# Altium schematic sheet Main.SchDoc: PWR+Radio+MCU+PA
size A3; SheetNumber: 2; SheetTotal: 2; Time: PWR+Radio+MCU+PA
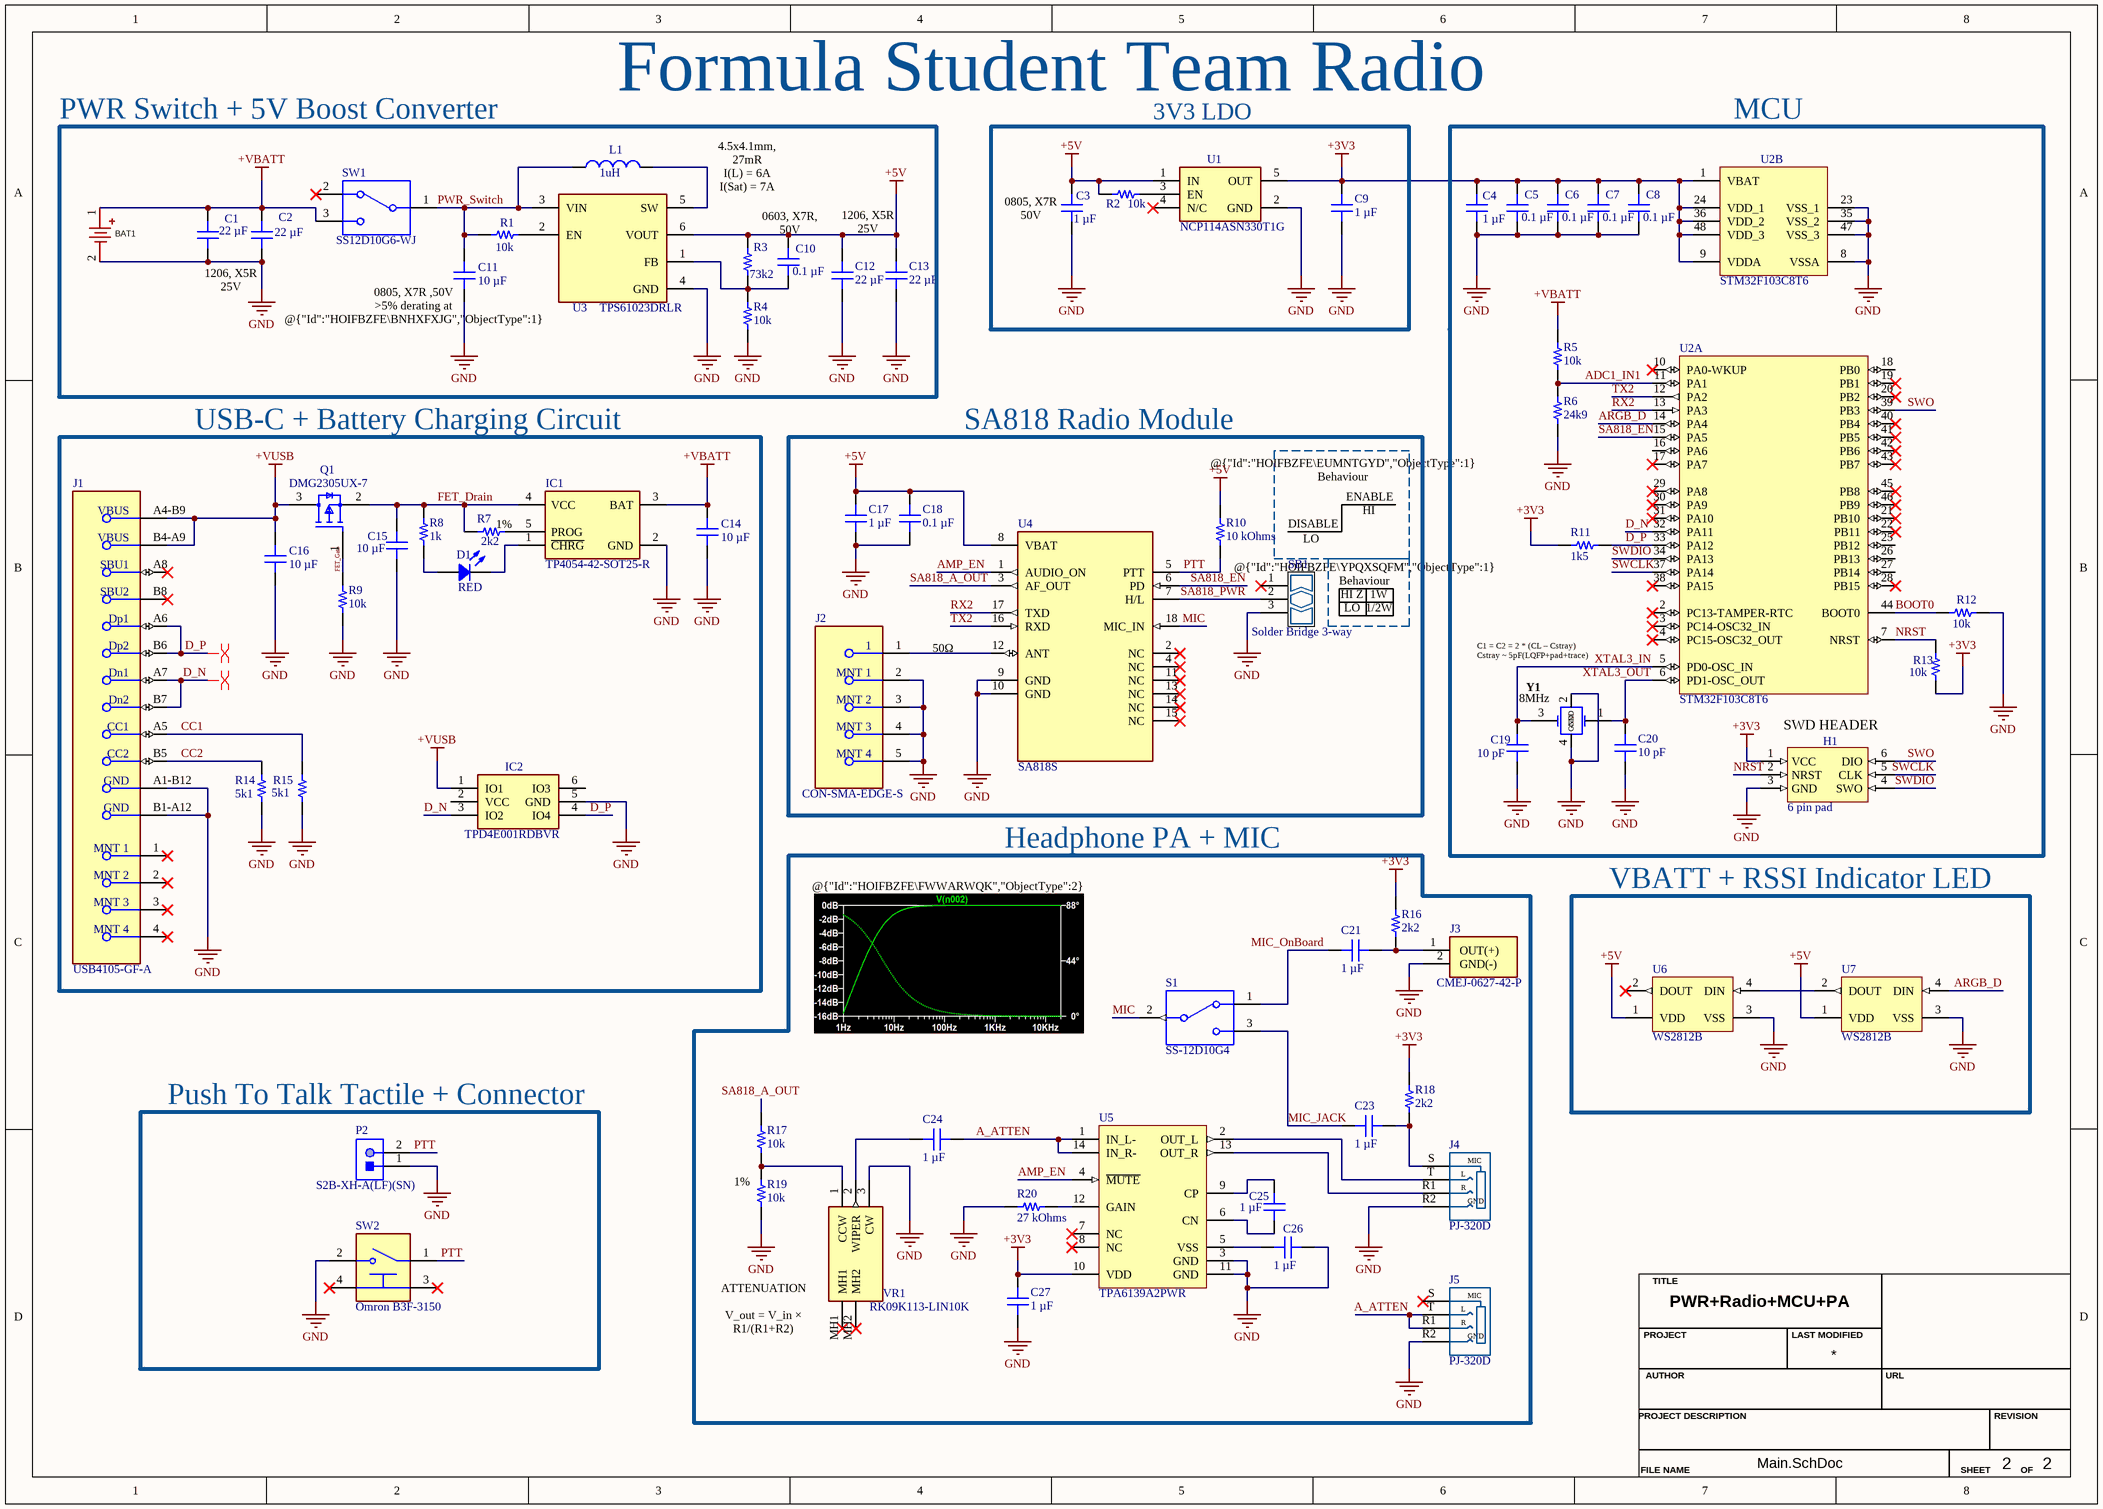
[diagram p0: Main.SchDoc]

## Parts
BAT1  BH-123A-A1CJ002  [BAT-TH_BH-123A-A5BJ002]  (value not drawn)
C1  22 µF  [MURATA CAP GRM31C 1206_3216]
C2  22 µF  [MURATA CAP GRM31C 1206_3216]
C3  1 µF  [MURATA GRT21 0805_2012]
C4  1 µF  [MURATA GRT21 0805_2012]
C5  0.1 µF  [CAP 0603_1608]
C6  0.1 µF  [CAP 0603_1608]
C7  0.1 µF  [CAP 0603_1608]
C8  0.1 µF  [CAP 0603_1608]
C9  1 µF  [MURATA GRT21 0805_2012]
C10  0.1 µF  [CAP 0603_1608]
C11  10 µF  [MURATA GRM21B 0805_2012]
C12  22 µF  [MURATA CAP GRM31C 1206_3216]
C13  22 µF  [MURATA CAP GRM31C 1206_3216]
C14  10 µF  [MURATA GRM21B 0805_2012]
C15  10 µF  [MURATA GRM21B 0805_2012]
C16  10 µF  [MURATA GRM21B 0805_2012]
C17  1 µF  [MURATA GRT21 0805_2012]
C18  0.1 µF  [CAP 0603_1608]
C19  10 pF  [MURATA GCM188 0603_1608]
C20  10 pF  [MURATA GCM188 0603_1608]
C21  1 µF  [MURATA GRT21 0805_2012]
C23  1 µF  [MURATA GRT21 0805_2012]
C24  1 µF  [MURATA GRT21 0805_2012]
C25  1 µF  [MURATA GRT21 0805_2012]
C26  1 µF  [MURATA GRT21 0805_2012]
C27  1 µF  [MURATA GRT21 0805_2012]
D1  RED  [LED 0603_1608 RED]
H1  6 pin pad  [6 pin pad-Footprint-1]
IC1  TP4054-42-SOT25-R  [SOT95P280X100-5N]
IC2  TPD4E001RDBVR  [SOT95P280X145-6N]
J1  USB4105-GF-A  [FP-USB4105-GF-A-MFG]
J2  CON-SMA-EDGE-S  [FP-CON-SMA-EDGE-S-MFG]
J3  CMEJ-0627-42-P  [CMEJ062742P]
J4  PJ-320D  [PJ320D]
J5  PJ-320D  [PJ320D]
L1  1uH  [INDM4843X20N]
P2  S2B-XH-A(LF)(SN)  [JST-S2B-XH-A(LF)(SN)_V]
Q1  DMG2305UX-7  [FP-SOT23-IPC_C]
R1  10k  [RES 0603_1608]
R2  10k  [RES 0603_1608]
R3  73k2  [RES 0603_1608]
R4  10k  [RES 0603_1608]
R5  10k  [RES 0603_1608]
R6  24k9  [RES 0603_1608]
R7  2k2  [RES 0603_1608]
R8  1k  [RES 0603_1608]
R9  10k  [RES 0603_1608]
R10  10 kOhms  [RES 0603_1608]
R11  1k5  [RES 0603_1608]
R12  10k  [RES 0603_1608]
R13  10k  [RES 0603_1608]
R14  5k1  [KOA RES RK73 RN73 0603_1608]
R15  5k1  [KOA RES RK73 RN73 0603_1608]
R16  2k2  [RES 0603_1608]
R17  10k  [RES 0603_1608]
R18  2k2  [RES 0603_1608]
R19  10k  [RES 0603_1608]
R20  27 kOhms  [RES 0603_1608]
S1  SS-12D10G4  [SS12D10G4]
SB1  Solder Bridge 3-way  [Solder Bridge 3-way-Footprint-1]
SW1  SS12D10G6-WJ  [SHOU HAN SS12D10G6-WJ-Footprint-1]
SW2  Omron B3F-3150  [FP-B3F-3150-MFG]
U1  NCP114ASN330T1G  [SOT95P275X110-5N]
U2  STM32F103C8T6  [STM-LQFP48_L]  (parts A,B of 2)
U3  TPS61023DRLR  [FP-DRL0006A-MFG]
U4  SA818S  [XCVR_SA818S]
U5  TPA6139A2PWR  [PW0014A_N]
U6  WS2812B  [ADAI-WS2812B_V]
U7  WS2812B  [ADAI-WS2812B_V]
VR1  RK09K113-LIN10K  [RK09K113LIN10K]
Y1  8MHz  [Yajingxin TX32258M4DBDD2T-Footprint-1]

## Blocks framed on the sheet
PWR Switch + 5V Boost Converter: BAT1 C1 C2 C10-C13 L1 R1 R3 R4 SW1 U3
3V3 LDO: C3 C9 R2 U1
MCU: C4-C8 C19 C20 H1 R5 R6 R11-R13 U2 Y1
USB-C + Battery Charging Circuit: C14-C16 D1 IC1 IC2 J1 Q1 R7-R9 R14 R15
SA818 Radio Module: C17 C18 J2 R10 SB1 U4
Headphone PA + MIC: C21 C23-C27 J3-J5 R16-R20 S1 U5 VR1
VBATT + RSSI Indicator LED: U6 U7
Push To Talk Tactile + Connector: P2 SW2

## Nets
+3V3: C4.2 C5.2 C6.2 C7.2 C8.2 C9.2 C27.1 H1.1(VCC) R11.2 R13.2 R16.2 R18.1 U1.5(OUT) U2.1(VBAT) U2.9(VDDA) U2.24(VDD_1) U2.36(VDD_2) U2.48(VDD_3) U5.10(VDD)
+5V: C3.2 C10.2 C12.2 C13.2 C17.2 C18.2 R2.1 R3.2 R10.2 U1.1(IN) U3.6(VOUT) U4.8(VBAT) U6.1(VDD) U7.1(VDD)
+VBATT: BAT1.1 C1.2 C2.2 C14.2 IC1.3(BAT) R5.2 SW1.3
+VUSB: C16.2 IC2.1(IO1) J1.A4-B9(VBUS) J1.B4-A9(VBUS) Q1.3(DRAIN)
GND: BAT1.2 C1.1 C2.1 C3.1 C4.1 C5.1 C6.1 C7.1 C8.1 C9.1 C11.1 C12.1 C13.1 C14.1 C15.1 C16.1 C17.1 C18.1 C19.1 C20.1 C26.2 C27.2 H1.3(GND) IC1.2(GND) IC2.5(GND) J1.A1-B12(GND) J1.B1-A12(GND) J2.2(MNT_1) J2.3(MNT_2) J2.4(MNT_3) J2.5(MNT_4) J3.2(GND(-)) J4.R2 J5.R2 P2.1 R4.1 R6.1 R9.1 R12.1 R14.1 R15.1 R19.1 R20.1 SB1.3 SW2.2 U1.2(GND) U2.8(VSSA) U2.23(VSS_1) U2.35(VSS_2) U2.47(VSS_3) U3.4(GND) U4.9(GND) U4.10(GND) U5.3(GND) U5.11(GND) U6.3(VSS) U7.3(VSS) VR1.3(CW) Y1.2(GND) Y1.4(GND)
A_ATTEN: C24.1 J5.R1 J5.T U5.1(IN_L-) U5.14(IN_R-)
ADC1_IN1: R5.1 R6.2 U2.11(PA1)
AMP_EN: U4.1(AUDIO_ON) U5.4(~{MUTE})
ARGB_D: U2.14(PA4) U7.4(DIN)
BOOT0: R12.2 U2.44(BOOT0)
CC1: J1.A5(CC1) R15.2
CC2: J1.B5(CC2) R14.2
D_N: IC2.3(IO2) J1.A7(Dn1) J1.B7(Dn2) U2.32(PA11)
D_P: IC2.4(IO4) J1.A6(Dp1) J1.B6(Dp2) R11.1 U2.33(PA12)
FET_Drain: C15.2 IC1.4(VCC) Q1.2(SOURCE) R7.1 R8.2
FET_Gate: Q1.1(GATE) R9.2
MIC: S1.2 U4.18(MIC_IN)
MIC_JACK: C23.2 S1.3
MIC_OnBoard: C21.2 S1.1
NRST: H1.2(NRST) R13.1 U2.7(NRST)
PTT: P2.2 R10.1 SW2.1 U4.5(PTT)
PWR_Switch: C11.2 L1.1 R1.1 SW1.1 U3.3(VIN)
RX2: U2.13(PA3) U4.17(TXD)
SA818_A_OUT: R17.2 U4.3(AF_OUT)
SA818_EN: U2.15(PA5) U4.6(PD)
SA818_PWR: SB1.2 U4.7(H/L)
SWCLK: H1.5(CLK) U2.37(PA14)
SWDIO: H1.4(SWO) U2.34(PA13)
SWO: H1.6(DIO) U2.39(PB3)
TX2: U2.12(PA2) U4.16(RXD)
XTAL3_IN: C19.2 U2.5(PD0-OSC_IN) Y1.3
XTAL3_OUT: C20.2 U2.6(PD1-OSC_OUT) Y1.1
NetC10_1: C10.1 R3.1 R4.2 U3.1(FB)
NetC21_1: C21.1 J3.1(OUT(+)) R16.1
NetC23_1: C23.1 J4.S R18.2
NetC24_2: C24.2 VR1.2(WIPER)
NetC25_1: C25.1 U5.9(CP)
NetC25_2: C25.2 U5.6(CN)
NetC26_1: C26.1 U5.5(VSS)
NetD1_1: D1.1 R8.1
NetD1_2: D1.2 IC1.1(~{CHRG})
NetIC1_5: IC1.5(PROG) R7.2
NetJ2_1: J2.1 U4.12(ANT)
NetJ4_R1: J4.R1 U5.13(OUT_R)
NetJ4_T: J4.T U5.2(OUT_L)
NetL1_2: L1.2 U3.5(SW)
NetR1_2: R1.2 U3.2(EN)
NetR2_2: R2.2 U1.3(EN)
NetR17_1: R17.1 R19.2 VR1.1(CCW)
NetR20_2: R20.2 U5.12(GAIN)
NetU6_4: U6.4(DIN) U7.2(DOUT)

Not connected (* = marked no-connect by the designer): IC2 2(VCC) 6(IO3); J1 1(MNT_1)* 2(MNT_2)* 3(MNT_3)* 4(MNT_4)* A8(SBU1)* B8(SBU2)*; J5 S*; SB1 1*; SW1 2(1)*; SW2 3(MNT_1)* 4(MNT_2)*; U1 4(N/C)*; U2 2(PC13-TAMPER-RTC)* 3(PC14-OSC32_IN)* 4(PC15-OSC32_OUT)* 10(PA0-WKUP)* 16(PA6) 17(PA7)* 18(PB0) 19(PB1)* 20(PB2)* 21(PB10)* 22(PB11)* 25(PB12) 26(PB13) 27(PB14) 28(PB15)* 29(PA8)* 30(PA9)* 31(PA10)* 38(PA15)* 40(PB4)* 41(PB5)* 42(PB6)* 43(PB7)* 45(PB8)* 46(PB9)*; U4 2(NC)* 4(NC)* 11(NC)* 13(NC)* 14(NC)* 15(NC)*; U5 7(NC)* 8(NC)*; U6 2(DOUT)*; VR1 MH1* MH2*

## Layout directives
differential pair: D_N, D_P

## Notes on the sheet
- Formula Student Team Radio
- 4.5x4.1mm, 27mR
  I(L) = 6A
  I(Sat) = 7A
- 0603, X7R, 50V
- 1206, X5R 25V
- (near C3) 0805, X7R
  50V
- (near C11) 0805, X7R ,50V
  >5% derating at @{"Id":"HOIFBZFE\BNHXFXJG","ObjectType":1}
- @{"Id":"HOIFBZFE\EUMNTGYD","ObjectType":1}
  Behaviour
- ENABLE
- HI
- (near R7) 1%
- DISABLE
- (near SB1) LO
- (near SB1) @{"Id":"HOIFBZFE\YPQXSQFM","ObjectType":1}
  Behaviour
- (near J2) 50Ω
- (near SB1) HI Z
- LO
- 1W
- 1/2W
- (near Y1) C1 = C2 = 2 * (CL – Cstray)
  Cstray ~ 5pF(LQFP+pad+trace)
- SWD HEADER
- @{"Id":"HOIFBZFE\FWWARWQK","ObjectType":2} + @{"Id":"HOIFBZFE\FYSAWRPW","ObjectType":2} High pass filter
- (near R19) 1%
- (near VR1) ATTENUATION
  V_out = V_in × R1/(R1+R2)
- TITLE
- AUTHOR
- PROJECT
- LAST MODIFIED
- URL
- PROJECT DESCRIPTION
- REVISION
- FILE NAME
- SHEET
- OF
- (in symbol PJ-320D) MIC; L; R; GND

## Library data of the parts
BAT1 = CMP-00029-00002-4: Manufacturer: MYOUNG(美阳); Convert to PCB: yes; Connector Type: Battery Holder; Symbol: BH-123A-A5BJ002; Battery Type: CR123A; Manufacturer Part: BH-123A-A1CJ002; Supplier Footprint: -; JLCPCB Part Class: Extended Part; Contact Material: Stainless Steel; Contact Plating: Nickel; Source: BH-123A-A5BJ0021_BH-123A-A5BJ002.SCHLIB; LCSC Part Name: 电池盒 适用电池:CR123A; Operating Temperature: -25℃~+85℃; Design Item ID: BH-123A-A1CJ002; Supplier Part: C5290177; Datasheet: https://item.szlcsc.com/datasheet/BH-123A-A1CJ002/6030883.html; Add into BOM: yes; Device: BH-123A-A1CJ002
C1 C2 C12 C13 = GRM31CC81E226KE11L: CAP CER 22UF 25V X6S 1206; manufacturer: Murata Electronics; Tolerance: ±10%; Part Number: GRM31CC81E226KE11L; Capacitance: 22 µF; Applications: General Purpose; componentlink1description: Datasheet; componentlink1url: https://search.murata.co.jp/Ceramy/image/img/A01X/G101/ENG/GRM31CC81E226KE11-01.pdf; componentlink2description: DigiKey Link; componentlink2url: https://www.digikey.com/en/products/detail/murata-electronics/GRM31CC81E226KE11L/6606097; Device Package: 1206 (3216 Metric); lastupdated: 7/27/2025 6:13:51 AM; Lifecycle Status: Active; Minimum Order: 1; Mounting Type: Surface Mount, MLCC; Operating Temperature: -55°C ~ 105°C; Package / Case: 1206 (3216 Metric); packaging: TapeAndReel; partid: 31407; Part Status: Active; price: 0.31; series: GRM; Size / Dimension: 0.126" L x 0.063" W (3.20mm x 1.60mm); Supplier 1: DigiKey; Supplier Part Number 1: 490-14468-1-ND; Temperature Coefficient: X6S; Thickness (Max): 0.075" (1.90mm); value: 22 µF; Voltage - Rated: 25V
C3 C4 C9 C17 C21 C23-C27 = GRT21BR71H105KE01L: CAP CER 1UF 50V X7R 0805; manufacturer: Murata Electronics; Tolerance: ±10%; Part Number: GRT21BR71H105KE01L; Capacitance: 1 µF; Applications: Automotive; componentlink1description: Datasheet; componentlink1url: https://search.murata.co.jp/Ceramy/image/img/A01X/G101/ENG/GRT21BR71H105KE01-01.pdf; componentlink2description: DigiKey Link; componentlink2url: https://www.digikey.com/en/products/detail/murata-electronics/GRT21BR71H105KE01L/10702345; Device Package: 0805 (2012 Metric); lastupdated: 7/27/2025 6:11:26 AM; Lifecycle Status: Active; Minimum Order: 1; Mounting Type: Surface Mount, MLCC; Operating Temperature: -55°C ~ 125°C; Package / Case: 0805 (2012 Metric); packaging: TapeAndReel; partid: 48766; Part Status: Active; price: 0.03; Ratings: AEC-Q200; series: GRT; Size / Dimension: 0.079" L x 0.049" W (2.00mm x 1.25mm); Supplier 1: DigiKey; Supplier Part Number 1: 490-GRT21BR71H105KE01LCT-ND; Temperature Coefficient: X7R; Thickness (Max): 0.053" (1.35mm); value: 1 µF; Voltage - Rated: 50V
C5-C8 C10 C18 = GCJ188R71H104KA12D: CAP CER 0.1UF 50V X7R 0603; manufacturer: Murata Electronics; Tolerance: ±10%; Part Number: GCJ188R71H104KA12D; Capacitance: 0.1 µF; Applications: Automotive, Boardflex Sensitive; componentlink1description: Datasheet; componentlink1url: https://www.murata.com/~/media/webrenewal/support/library/catalog/products/capacitor/mlcc/c03e.ashx?la=en-us; componentlink2description: DigiKey Link; componentlink2url: https://www.digikey.com/en/products/detail/murata-electronics/GCJ188R71H104KA12D/2783803; Device Package: 0603 (1608 Metric); Features: Soft Termination; lastupdated: 2/9/2024 8:10:08 PM; Lifecycle Status: Active; Minimum Order: 1; Mounting Type: Surface Mount, MLCC; Operating Temperature: -55°C ~ 125°C; Package / Case: 0603 (1608 Metric); packaging: TapeAndReel; partid: 16867; Part Status: Active; price: 0.01; Ratings: AEC-Q200; series: GCJ; Size / Dimension: 0.063" L x 0.031" W (1.60mm x 0.80mm); Supplier 1: DigiKey; Supplier Part Number 1: 490-5798-1-ND; Temperature Coefficient: X7R; Thickness (Max): 0.035" (0.90mm); value: 0.1 µF; Voltage - Rated: 50V
C11 C14-C16 = GRM21BR61H106ME43L: CAP CER 10UF 50V X5R 0805; manufacturer: Murata Electronics; Tolerance: ±20%; Part Number: GRM21BR61H106ME43L; Capacitance: 10 µF; Applications: General Purpose; componentlink1description: Datasheet; componentlink1url: https://search.murata.co.jp/Ceramy/image/img/A01X/G101/ENG/GRM21BR61H106ME43-01A.pdf; componentlink2description: DigiKey Link; componentlink2url: https://www.digikey.com/en/products/detail/murata-electronics/GRM21BR61H106ME43L/10326317; Device Package: 0805 (2012 Metric); lastupdated: 8/27/2024 9:29:56 AM; Lifecycle Status: Active; Minimum Order: 1; Mounting Type: Surface Mount, MLCC; Operating Temperature: -55°C ~ 85°C; Package / Case: 0805 (2012 Metric); packaging: TapeAndReel; partid: 41295; Part Status: Active; price: 0.05; series: GRM; Size / Dimension: 0.079" L x 0.049" W (2.00mm x 1.25mm); Supplier 1: DigiKey; Supplier Part Number 1: 490-18664-1-ND; Temperature Coefficient: X5R; Thickness (Max): 0.057" (1.45mm); value: 10 µF; Voltage - Rated: 50V
C19 C20 = GCM1885C2A100FA16D: CAP CER 10PF 100V C0G/NP0 0603; manufacturer: Murata Electronics; Temperature Coefficient: C0G, NP0; Tolerance: ±1%; Part Number: GCM1885C2A100FA16D; Capacitance: 10 pF; Applications: Automotive; componentlink1description: Datasheet; componentlink1url: https://search.murata.co.jp/Ceramy/image/img/A01X/G101/ENG/GCM1885C2A100FA16-01.pdf; componentlink2description: DigiKey Link; componentlink2url: https://www.digikey.com/en/products/detail/murata-electronics/GCM1885C2A100FA16D/11618736; Device Package: 0603 (1608 Metric); lastupdated: 7/20/2024 12:24:59 AM; Lifecycle Status: Active; Minimum Order: 1; Mounting Type: Surface Mount, MLCC; Operating Temperature: -55°C ~ 125°C; Package / Case: 0603 (1608 Metric); packaging: TapeAndReel; partid: 36047; Part Status: Active; price: 0.02; Ratings: AEC-Q200; series: GCM; Size / Dimension: 0.063" L x 0.031" W (1.60mm x 0.80mm); Supplier 1: DigiKey; Supplier Part Number 1: 490-GCM1885C2A100FA16DCT-ND; Thickness (Max): 0.035" (0.90mm); value: 10 pF; Voltage - Rated: 100V
D1 = B1931URO-20D000114U1930: LED RED DIFFUSED 0603 SMD; Manufacturer: Harvatek Corporation; Current - Test: 20mA; Lens Size: 1.00mm x 0.80mm; Lens Style: Rectangle with Flat Top; Millicandela Rating: 45mcd; Viewing Angle: 125°, 135°; Voltage - Forward (Vf) (Typ): 2V; Wavelength - Peak: 639nm; Part Number: B1931URO-20D000114U1930; Color: Red; ComponentLink2Description: DigiKey Link; ComponentLink2URL: https://www.digikey.com/en/products/detail/harvatek-corporation/B1931URO-20D000114U1930/15910603; Device Package: 0603 (1608 Metric); LastUpdated: 6/3/2024 7:59:45 PM; Lens Transparency: Diffused; Lifecycle Status: Active; Minimum Order: 1; Mounting Type: Surface Mount; Package / Case: 0603 (1608 Metric); Packaging: TapeAndReel; PartId: 1009; Part Status: Active; Price: 0.04; Series: -; Size / Dimension: 1.60mm L x 0.80mm W; Supplier 1: DigiKey; Supplier Part Number 1: 3147-B1931URO-20D000114U1930CT-ND; Supplier Device Package: 0603
H1 = CMP-002-00084-1
IC1 = TP4054-42-SOT25-R: Integrated Circuit; Manufacturer_Name: TOP POWER; Datasheet Link: http://images.100y.com.tw/pdf_file/38-TP-TP4054x.pdf; Height: 1mm; Manufacturer_Part_Number: TP4054-42-SOT25-R
IC2 = TPD4E001RDBVR: Integrated Circuit; Manufacturer_Name: Texas Instruments; Datasheet Link: http://www.ti.com/lit/gpn/TPD4E001; Height: 1.45mm; Manufacturer_Part_Number: TPD4E001RDBVR; Mouser Part Number: 595-TPD4E001RDBVR; Mouser Price/Stock: https://www.mouser.co.uk/ProductDetail/Texas-Instruments/TPD4E001RDBVR?qs=P1JMDcb91o7xMbcYcXI1uw%3D%3D; Arrow Part Number: TPD4E001RDBVR; Arrow Price/Stock: https://www.arrow.com/en/products/tpd4e001rdbvr/texas-instruments?utm_currency=USD&region=nac
J1 = CMP-002-00071-2: Conn USB 2.0 Type C RCP 24 POS 0.3mm/0.5mm Solder RA SMD 24 Terminal 1 Port T/R
J2 = CMP-002-00085-1: Sma Female Connector, Pcb Edge Mount Rohs Compliant: Yes; Case/Package: SMA; Pins: 1
J3 = CMEJ-0627-42-P: Connector; Manufacturer_Name: Same Sky; Datasheet Link: https://www.sameskydevices.com/product/resource/cmej-0627-42-p.pdf; Height: 3.18mm; Manufacturer_Part_Number: CMEJ-0627-42-P; Mouser Part Number: 490-CMEJ-0627-42-P; Mouser Price/Stock: https://www.mouser.co.uk/ProductDetail/CUI-Devices/CMEJ-0627-42-P?qs=PzGy0jfpSMsjZjkg1iQyPQ%3D%3D; Arrow Part Number: CMEJ-0627-42-P; Arrow Price/Stock: https://www.arrow.com/en/products/cmej-0627-42-p/cui-devices
J4 J5 = PJ-320D: Connector; Manufacturer_Name: Audio-Technica; Datasheet Link: https://p.globalsources.com/IMAGES/PDT/SPEC/432/K1007154432.pdf; Height: 5.75mm; Manufacturer_Part_Number: PJ-320D
L1 = CMP-006-00027-1: 1uH, 6A, 27mR, SMD 4.5x4.1mm
P2 = CMP-002-00032-2: Male Header, Pitch 2.5 mm, 1 x 2 Position, Height 6.1 mm, Tail Length 3.4 mm, -25 to 85 degC, RoHS, Bulk; Manufacturer: JST; Case/Package: S2B-XH-A(LF)(SN); Package Description: XH Series Disconnectable Crimp Style Connector, Pitch 2.5 mm, 1 x 2 Position, Height 6.1 mm, Tail Length 3.4 mm; Manufacturer URL: http://www.jst.com/home2.html; Datasheet URL: http://www.jst-mfg.com/product/pdf/eng/eXH.pdf; Connector Type: Header; Package Reference: S2B-XH-A(LF)(SN); Mounting Technology: TH; Max Operating Temperature: 85°C; Min Operating Temperature: -25°C; Datasheet Version: May-16; Gender: Male; RoHS Compliant: Unknown
Q1 = CMP-019-00063-1: P-Channel 20 V 52 mOhm Surface Mount Enhancement Mode Mosfet - SOT-23-3; Max Power Dissipation: 1.4W; Pins: 3; Max Operating Temperature: 150°C; Mounting Technology: Surface Mount; Case/Package: SOT-23; Min Operating Temperature: -55°C
R1 R2 = RCS060310K0JNEA: RES SMD 10K OHM 5% 1/4W 0603; Manufacturer: Vishay Dale; Power (Watts): 0.25W, 1/4W; Resistance: 10 kOhms; Temperature Coefficient: ±200ppm/°C; Part Number: RCS060310K0JNEA; Value: 10k; ComponentLink1Description: Datasheet; ComponentLink1URL: http://www.vishay.com/docs/20065/rcse3.pdf; ComponentLink2Description: DigiKey Link; ComponentLink2URL: https://www.digikey.com/en/products/detail/vishay-dale/RCS060310K0JNEA/5866963; Composition: Thick Film; Device Package: 0603 (1608 Metric); Features: Automotive AEC-Q200, Pulse Withstanding; Height - Seated (Max): 0.020" (0.50mm); LastUpdated: 2/9/2024 8:43:35 PM; Lifecycle Status: Active; Minimum Order: 1; Number of Terminations: 2; Operating Temperature: -55°C ~ 155°C; Package / Case: 0603 (1608 Metric); Packaging: TapeAndReel; PartId: 5383; Part Status: Active; Price: 0.01; Ratings: AEC-Q200; Series: RCS e3; Size / Dimension: 0.061" L x 0.033" W (1.55mm x 0.85mm); Supplier 1: DigiKey; Supplier Part Number 1: 541-2817-1-ND; Supplier Device Package: 0603; Tolerance: ±5%
R3 = ESR03EZPF7322: ANTI-SURGE CHIP RESISTORS; Manufacturer: Rohm Semiconductor; Power (Watts): 0.25W, 1/4W; Resistance: 73.2 kOhms; Temperature Coefficient: ±100ppm/°C; Tolerance: ±1%; Part Number: ESR03EZPF7322; Value: 73k2; ComponentLink1Description: Datasheet; ComponentLink1URL: https://www.rohm.com/datasheet?p=ESR01MZPF&dist=Digi-key&media=referral&source=digi-key.com&campaign=Digi-key; ComponentLink2Description: DigiKey Link; ComponentLink2URL: https://www.digikey.com/en/products/detail/rohm-semiconductor/ESR03EZPF7322/20486496; Composition: Thick Film; Device Package: 0603 (1608 Metric); Features: Automotive AEC-Q200, Pulse Withstanding; Height - Seated (Max): 0.022" (0.55mm); LastUpdated: 2/9/2024 8:40:36 PM; Lifecycle Status: Active; Minimum Order: 1; Number of Terminations: 2; Operating Temperature: -55°C ~ 155°C; Package / Case: 0603 (1608 Metric); Packaging: TapeAndReel; PartId: 80019; Price: 0.02; Ratings: AEC-Q200; Series: ESR; Size / Dimension: 0.063" L x 0.031" W (1.60mm x 0.80mm); Supplier 1: DigiKey; Supplier Part Number 1: 511-ESR03EZPF7322CT-ND; Supplier Device Package: 0603
R4 R5 R8 R9 R17 = TNPW060310K0BETA: RES 10K OHM 0.1% 1/10W 0603; Manufacturer: Vishay Dale; Power (Watts): 0.1W, 1/10W; Resistance: 10 kOhms; Temperature Coefficient: ±25ppm/°C; Part Number: TNPW060310K0BETA; ComponentLink1Description: Datasheet; ComponentLink1URL: http://www.vishay.com/docs/31006/tnpw.pdf; ComponentLink2Description: DigiKey Link; ComponentLink2URL: https://www.digikey.com/en/products/detail/vishay-dale/TNPW060310K0BETA/1613679; Composition: Thin Film; Device Package: 0603 (1608 Metric); Features: Military; Height - Seated (Max): 0.022" (0.55mm); LastUpdated: 2/9/2024 8:42:58 PM; Lifecycle Status: Active; Minimum Order: 1; Number of Terminations: 2; Operating Temperature: -55°C ~ 125°C; Package / Case: 0603 (1608 Metric); Packaging: TapeAndReel; PartId: 14670; Part Status: Active; Price: 0.27; Series: TNPW; Size / Dimension: 0.063" L x 0.033" W (1.60mm x 0.85mm); Supplier 1: DigiKey; Supplier Part Number 1: 541-3574-1-ND; Supplier Device Package: 0603; Tolerance: ±0.1%
  R4 R5 R9 R17: Value: 10k
  R8: Value: 1k
R6 = RQ73C1J24K9BTDF: RQ 0603 24K9 0.1% 10PPM 1K RL; Manufacturer: TE Connectivity Passive Product; Power (Watts): 0.15W; Resistance: 24.9 kOhms; Temperature Coefficient: ±10ppm/°C; Part Number: RQ73C1J24K9BTDF; Value: 24k9; ComponentLink1Description: Datasheet; ComponentLink1URL: https://www.te.com/commerce/DocumentDelivery/DDEController?Action=srchrtrv&DocNm=1773270-2&DocType=DS&DocLang=English; ComponentLink2Description: DigiKey Link; ComponentLink2URL: https://www.digikey.com/en/products/detail/te-connectivity-passive-product/RQ73C1J24K9BTDF/13941756; Composition: Thin Film; Device Package: 0603 (1608 Metric); Features: Anti-Sulfur, Automotive AEC-Q200, Moisture Resistant; Height - Seated (Max): 0.022" (0.55mm); LastUpdated: 2/9/2024 8:41:25 PM; Lifecycle Status: Active; Minimum Order: 1; Number of Terminations: 2; Operating Temperature: -55°C ~ 155°C; Package / Case: 0603 (1608 Metric); Packaging: TapeAndReel; PartId: 62758; Part Status: Active; Price: 0.38; Ratings: AEC-Q200; Series: RQ73; Size / Dimension: 0.061" L x 0.031" W (1.55mm x 0.80mm); Supplier 1: DigiKey; Supplier Part Number 1: 1712-RQ73C1J24K9BTDFCT-ND; Supplier Device Package: 0603; Tolerance: ±0.1%
R7 R16 R18 R19 = CMP0603QFX-2201ELF: RES CHIP 0603 2K2 1% 1/4W TC100; Manufacturer: Bourns Inc.; Power (Watts): 0.25W, 1/4W; Resistance: 2.2 kOhms; Temperature Coefficient: ±100ppm/°C; Part Number: CMP0603QFX-2201ELF; ComponentLink1Description: Datasheet; ComponentLink1URL: https://www.bourns.com/docs/Product-Datasheets/CMP-Q.pdf; ComponentLink2Description: DigiKey Link; ComponentLink2URL: https://www.digikey.com/en/products/detail/bourns-inc/CMP0603QFX-2201ELF/17737299; Composition: Thick Film; Device Package: 0603 (1608 Metric); Features: Automotive AEC-Q200, Pulse Withstanding; Height - Seated (Max): 0.022" (0.55mm); LastUpdated: 2/9/2024 8:41:02 PM; Lifecycle Status: Active; Minimum Order: 1; Number of Terminations: 2; Operating Temperature: -55°C ~ 155°C; Package / Case: 0603 (1608 Metric); Packaging: TapeAndReel; PartId: 78343; Part Status: Active; Price: 0.02; Ratings: AEC-Q200; Series: CMP-Q; Size / Dimension: 0.063" L x 0.031" W (1.60mm x 0.80mm); Supplier 1: DigiKey; Supplier Part Number 1: 118-CMP0603QFX-2201ELFCT-ND; Supplier Device Package: 0603; Tolerance: ±1%
  R7 R16 R18: Value: 2k2
  R19: Value: 10k
R10 = RCS060310K0JNEA: RES SMD 10K OHM 5% 1/4W 0603; Manufacturer: Vishay Dale; Power (Watts): 0.25W, 1/4W; Temperature Coefficient: ±200ppm/°C; Part Number: RCS060310K0JNEA; Value: 10 kOhms; ComponentLink1Description: Datasheet; ComponentLink1URL: http://www.vishay.com/docs/20065/rcse3.pdf; ComponentLink2Description: DigiKey Link; ComponentLink2URL: https://www.digikey.com/en/products/detail/vishay-dale/RCS060310K0JNEA/5866963; Composition: Thick Film; Device Package: 0603 (1608 Metric); Features: Automotive AEC-Q200, Pulse Withstanding; Height - Seated (Max): 0.020" (0.50mm); LastUpdated: 2/9/2024 8:43:35 PM; Lifecycle Status: Active; Minimum Order: 1; Number of Terminations: 2; Operating Temperature: -55°C ~ 155°C; Package / Case: 0603 (1608 Metric); Packaging: TapeAndReel; PartId: 5383; Part Status: Active; Price: 0.01; Ratings: AEC-Q200; Resistance: 10 kOhms; Series: RCS e3; Size / Dimension: 0.061" L x 0.033" W (1.55mm x 0.85mm); Supplier 1: DigiKey; Supplier Part Number 1: 541-2817-1-ND; Supplier Device Package: 0603; Tolerance: ±5%
R11 = RNCP0603FTD1K50: RES 1.5K OHM 1% 1/8W 0603; Manufacturer: Stackpole Electronics Inc; Power (Watts): 0.125W, 1/8W; Resistance: 1.5 kOhms; Temperature Coefficient: ±100ppm/°C; Part Number: RNCP0603FTD1K50; Value: 1k5; ComponentLink1Description: Datasheet; ComponentLink1URL: https://www.seielect.com/catalog/sei-rncp.pdf; ComponentLink2Description: DigiKey Link; ComponentLink2URL: https://www.digikey.com/en/products/detail/stackpole-electronics-inc/RNCP0603FTD1K50/2240110; Composition: Thin Film; Device Package: 0603 (1608 Metric); Features: Anti-Sulfur; Height - Seated (Max): 0.022" (0.55mm); LastUpdated: 2/9/2024 8:43:33 PM; Lifecycle Status: Active; Minimum Order: 1; Number of Terminations: 2; Operating Temperature: -55°C ~ 155°C; Package / Case: 0603 (1608 Metric); Packaging: TapeAndReel; PartId: 5700; Part Status: Active; Price: 0.01; Series: RNCP; Size / Dimension: 0.061" L x 0.031" W (1.55mm x 0.80mm); Supplier 1: DigiKey; Supplier Part Number 1: RNCP0603FTD1K50CT-ND; Supplier Device Package: 0603; Tolerance: ±1%
R12 R13 = CRCW060310K0JNEAC: RES 10K OHM 5% 1/10W 0603; Manufacturer: Vishay Dale; Power (Watts): 0.1W, 1/10W; Resistance: 10 kOhms; Temperature Coefficient: ±200ppm/°C; Part Number: CRCW060310K0JNEAC; Value: 10k; ComponentLink1Description: Datasheet; ComponentLink1URL: http://www.vishay.com/docs/28773/crcwce3.pdf; ComponentLink2Description: DigiKey Link; ComponentLink2URL: https://www.digikey.com/en/products/detail/vishay-dale/CRCW060310K0JNEAC/7928379; Composition: Thick Film; Device Package: 0603 (1608 Metric); Height - Seated (Max): 0.022" (0.55mm); LastUpdated: 2/9/2024 8:42:33 PM; Lifecycle Status: Active; Minimum Order: 1; Number of Terminations: 2; Operating Temperature: -55°C ~ 155°C; Package / Case: 0603 (1608 Metric); Packaging: CutTape; PartId: 21155; Part Status: Active; Price: 0.01; Series: CRCW-C; Supplier 1: DigiKey; Supplier Part Number 1: 541-3957-1-ND; Supplier Device Package: 0603; Tolerance: ±5%
R14 R15 = RK73B1JTTDD512J: RESISTOR; Manufacturer: KOA Speer Electronics, Inc.; Power (Watts): 0.1W, 1/10W; Resistance: 5.1 kOhms; Temperature Coefficient: ±200ppm/°C; Tolerance: ±5%; Part Number: RK73B1JTTDD512J; Value: 5k1; ComponentLink1Description: Datasheet; ComponentLink1URL: https://www.koaspeer.com/pdfs/RK73B.pdf; ComponentLink2Description: DigiKey Link; ComponentLink2URL: https://www.digikey.com/en/products/detail/koa-speer-electronics-inc/RK73B1JTTDD512J/21680160; Composition: Thick Film; Device Package: 0603 (1608 Metric); Features: Automotive AEC-Q200; Height - Seated (Max): 0.022" (0.55mm); LastUpdated: 7/25/2024 9:42:51 AM; Lifecycle Status: Active; Minimum Order: 1; Number of Terminations: 2; Operating Temperature: -55°C ~ 155°C; Package / Case: 0603 (1608 Metric); Packaging: CutTape; PartId: 89828; Price: 0.01; Ratings: AEC-Q200; Series: RK73B; Size / Dimension: 0.063" L x 0.031" W (1.60mm x 0.80mm); Supplier 1: DigiKey; Supplier Part Number 1: 2019-RK73B1JTTDD512JCT-ND; Supplier Device Package: 0603
R20 = CRCW060327K0JNEAC: RES 27K OHM 5% 1/10W 0603; Manufacturer: Vishay Dale; Power (Watts): 0.1W, 1/10W; Temperature Coefficient: ±200ppm/°C; Part Number: CRCW060327K0JNEAC; Value: 27 kOhms; ComponentLink1Description: Datasheet; ComponentLink1URL: https://www.vishay.com/docs/28773/crcwce3.pdf; ComponentLink2Description: DigiKey Link; ComponentLink2URL: https://www.digikey.com/en/products/detail/vishay-dale/CRCW060327K0JNEAC/7925460; Composition: Thick Film; Device Package: 0603 (1608 Metric); Height - Seated (Max): 0.022" (0.55mm); LastUpdated: 2/9/2024 8:41:17 PM; Lifecycle Status: Active; Minimum Order: 1; Number of Terminations: 2; Operating Temperature: -55°C ~ 155°C; Package / Case: 0603 (1608 Metric); Packaging: CutTape; PartId: 65823; Part Status: Active; Price: 0.01; Resistance: 27 kOhms; Series: CRCW-C; Size / Dimension: 0.063" L x 0.031" W (1.60mm x 0.80mm); Supplier 1: DigiKey; Supplier Part Number 1: 541-CRCW060327K0JNEACCT-ND; Supplier Device Package: 0603; Tolerance: ±5%
S1 = SS-12D10G4: Switch; Manufacturer_Name: XKB Connectivity; Datasheet Link: https://www.helloxkb.com/public/images/pdf/SS-12D10XXX.pdf; Height: 10.6mm; Manufacturer_Part_Number: SS-12D10G4
SB1 = CMP-00030-00002-3: 3-way solder bridge mainly for power rail selection
SW1 = CMP-011-00016-1: TH Right angle SPDT 3A Slide switch
SW2 = CMP-011-00015-1: Switch Tactile N.O. SPST Projected Plunger PC Pins 0.05A 24VDC 1000000Cycle 0.98N Thru-Hole Bag; Current Rating: 50mA; Mounting Technology: DIP, Through Hole; Max Operating Temperature: 70°C; Pins: 4; Throw Configuration: SPST; Min Operating Temperature: -25°C; Max Current Rating: 50mA
U1 = NCP114ASN330T1G: Power Supply; Manufacturer_Name: onsemi; Datasheet Link: https://www.onsemi.com/pub/Collateral/NCP114-D.PDF; Height: 1.1mm; Manufacturer_Part_Number: NCP114ASN330T1G; Mouser Part Number: 863-NCP114ASN330T1G; Mouser Price/Stock: https://www.mouser.co.uk/ProductDetail/onsemi/NCP114ASN330T1G?qs=OycAS1CGnljPBnaqdh%252BGIA%3D%3D; Arrow Part Number: NCP114ASN330T1G; Arrow Price/Stock: https://www.arrow.com/en/products/ncp114asn330t1g/on-semiconductor?utm_currency=USD&region=europe
U2 = CMP-020-00023-1: RISC Microcontroller, 32-Bit, FLASH, STM32 CPU, 72MHz, CMOS, PQFP48; Clock Frequency: 16MHz; Min Supply Voltage: 2V; Nominal Supply Voltage: 3.3V; Max Supply Voltage: 3.6V; Interface: I2C,SPI,USB,CAN,USART; Pins: 48; Min Operating Temperature: -40°C; Max Operating Temperature: 105°C; RoHS Compliant: Yes; Case/Package: LFQFP
U3 = CMP-019-00062-1: Switching Voltage Regulators 3.7-A boost converter with 0.5-V ultra-low input vo; Max Supply Voltage: 5.5V; Min Supply Voltage: 500mV; Output Current: 3.7A; Nominal Supply Current: 900nA; Min Operating Temperature: -40°C; Max Operating Temperature: 125°C; Pins: 6
U4 = CMP-015-000000-1: Walkie talkie module with RDA1846S chip; MF: G-nicerf; Value: *; Pin Count: 18; Source: SA818S.SchLib; Check_prices: https://www.snapeda.com/parts/SA818S/G-nicerf/view-part/?ref=eda; SnapEDA_Link: https://www.snapeda.com/parts/SA818S/G-nicerf/view-part/?ref=snap; Package: None; Design Item ID: SA818S; Component Type: Standard; MP: SA818S
U5 = CMP-00027-00002-1: 25-mW, stereo, analog input headphone amplifier with programmable gain 14-TSSOP -40 to 85; Max Operating Temperature: 150°C; Pins: 14; Min Operating Temperature: -40°C; Case/Package: TSSOP
U6 U7 = CMP-007-00035-2: Intelligent Control LED Integrated Light Source, 3.5 to 5.3 V, -25 to 80 degC, 4-Pin SMD, RoHS, Bulk; Manufacturer: Adafruit Industries; Datasheet URL: https://cdn-shop.adafruit.com/datasheets/WS2812B.pdf; Manufacturer URL: https://www.adafruit.com/; Datasheet Version: May-13; Case/Package: WS2812B; Mounting Technology: SM; RoHS Compliant: False; Package Description: 4-Pin Surface Mount Device, Body 5 x 5 mm, Pitch 3.3 mm; Package Reference: WS2812B
VR1 = RK09K113-LIN10K: Variable Resistor; Manufacturer_Name: ALPS Electric; Datasheet Link: https://cdn-reichelt.de/documents/datenblatt/203313RK09K1130A0H.pdf; Height: 25.5mm; Manufacturer_Part_Number: RK09K113-LIN10K
Y1 = CMP-003-00030-8: 8 MHz crystal, CL: 10pF, +/-10ppm